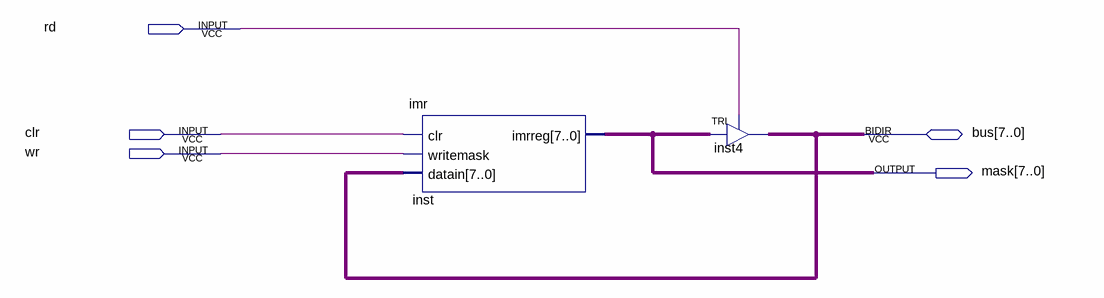
[diagram p0: schematic sheet]
// Quartus schematic imr_a.bdf as structural Verilog: 2 symbols, 5 pins
module imr_a (
  input  rd,
  input  clr,
  input  wr,
  inout  [7:0] bus,
  output [7:0] mask
);

  imr inst (.clr(clr), .writemask(wr), .datain(bus), .imrreg(mask));
  TRI inst4[7:0] (.IN(mask), .OE(rd), .OUT(bus));
endmodule
